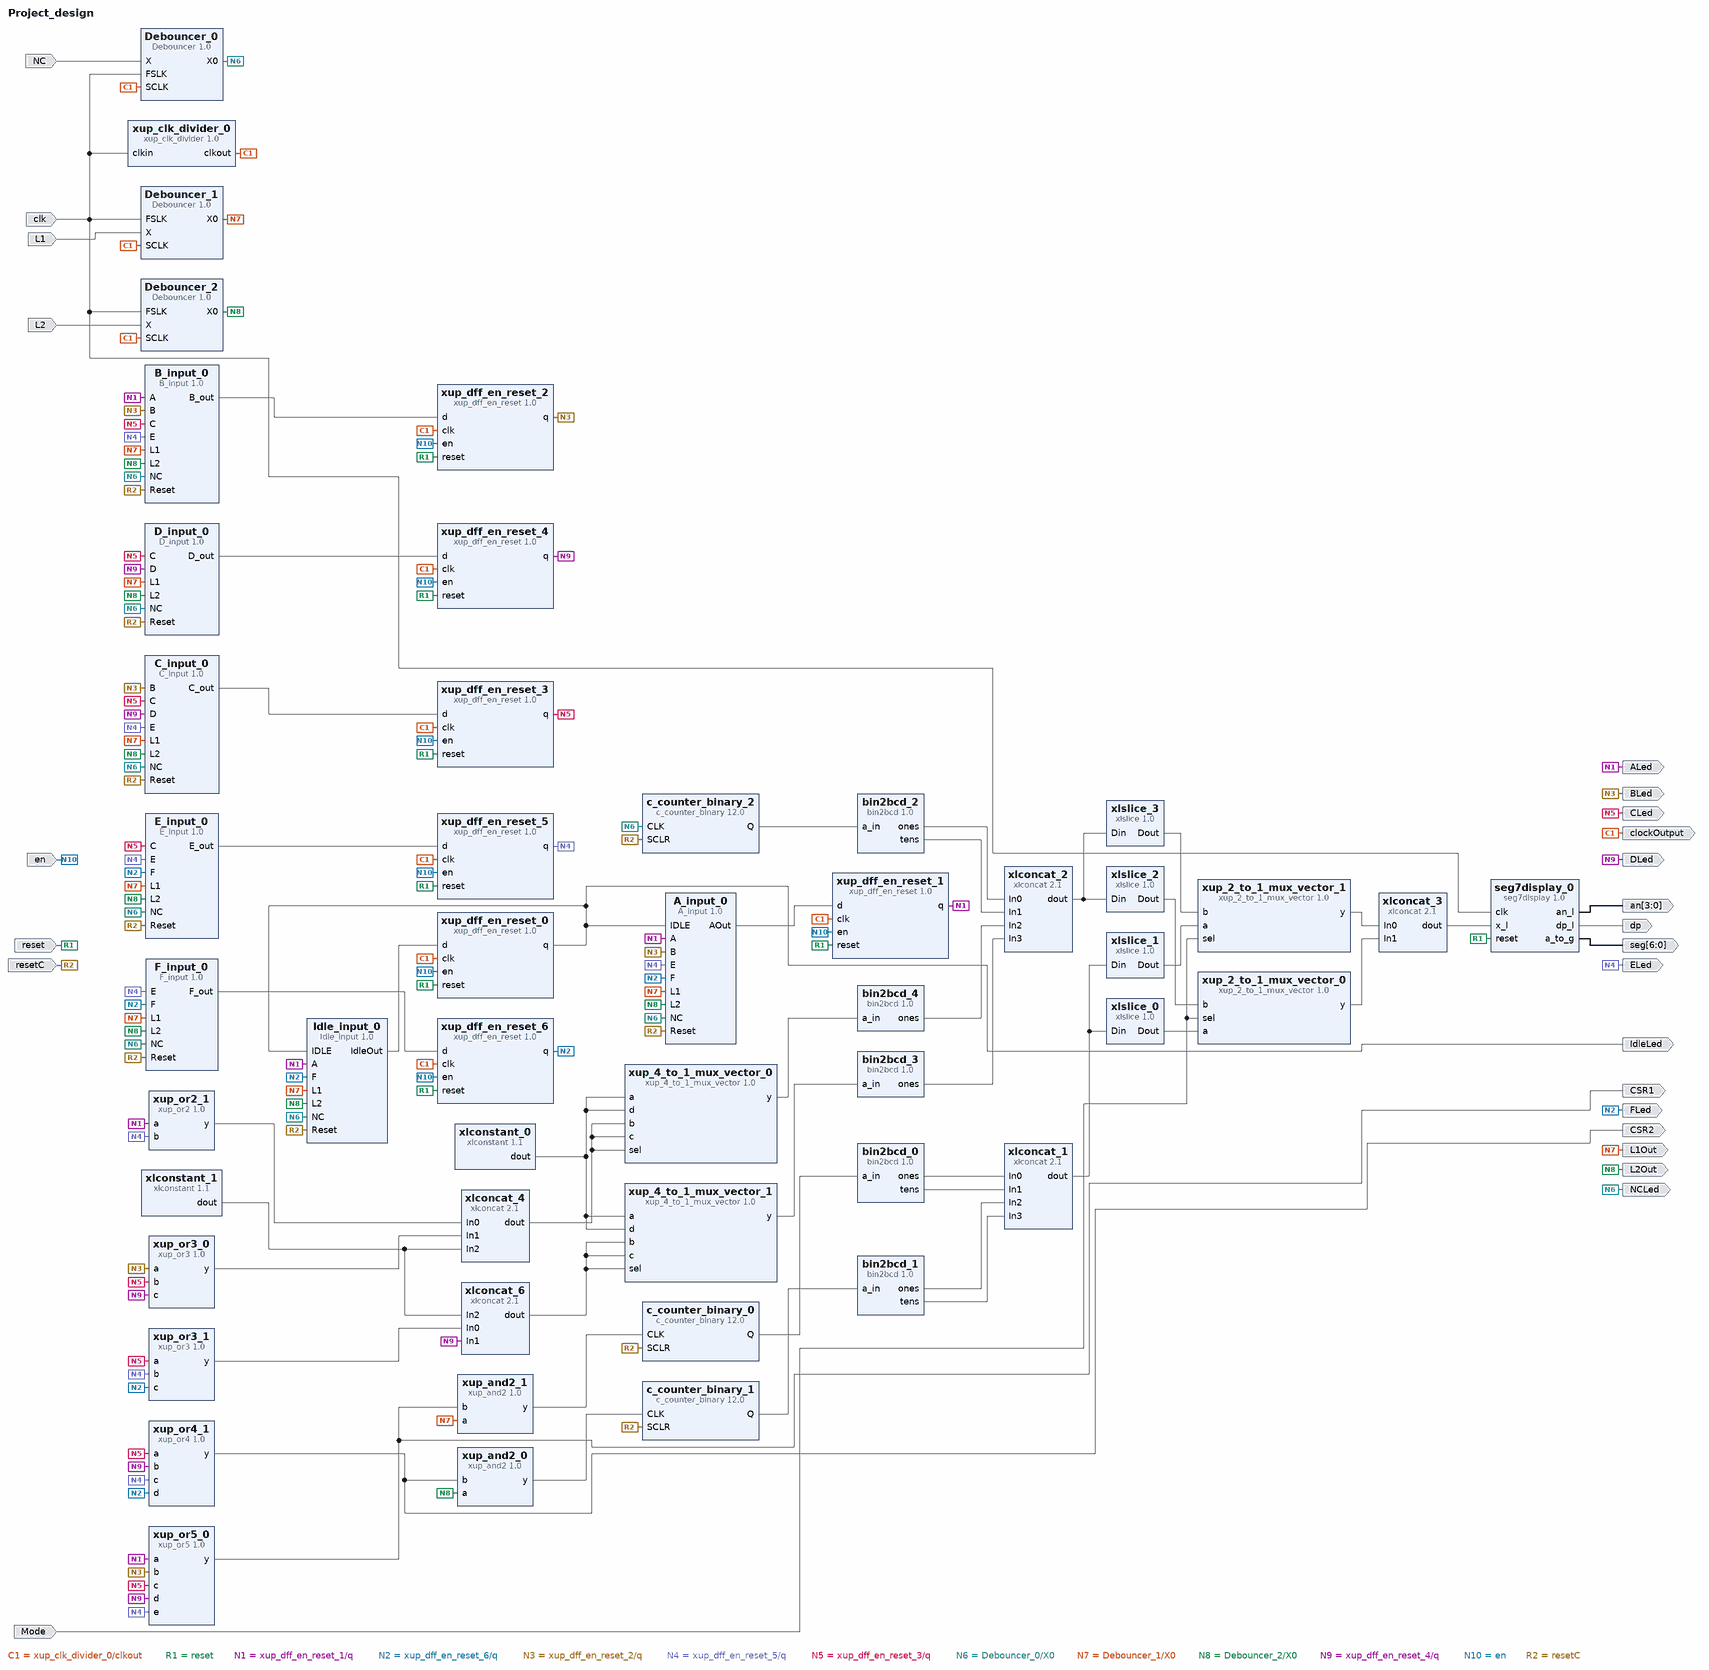
[diagram p0: block diagram of the top level]
# Vivado block design Project_design, xc7a35tcpg236-1, Vivado 2017.4
create_bd_design Project_design

create_bd_port -dir I -type clk clk
set_property -dict {CONFIG.FREQ_HZ 100000000} [get_bd_ports clk]
create_bd_port -dir O clockOutput
create_bd_port -dir I NC
create_bd_port -dir I L1
create_bd_port -dir I -type rst reset
set_property -dict {CONFIG.POLARITY ACTIVE_LOW} [get_bd_ports reset]
create_bd_port -dir O ALed
create_bd_port -dir O FLed
create_bd_port -dir O BLed
create_bd_port -dir O ELed
create_bd_port -dir O CLed
create_bd_port -dir O NCLed
create_bd_port -dir O L1Out
create_bd_port -dir O L2Out
create_bd_port -dir O DLed
create_bd_port -dir O CSR1
create_bd_port -dir O CSR2
create_bd_port -dir I L2
create_bd_port -dir O -from 6 -to 0 seg
create_bd_port -dir O IdleLed
create_bd_port -dir I en
create_bd_port -dir O dp
create_bd_port -dir O -from 3 -to 0 an
create_bd_port -dir I -type rst resetC
set_property -dict {CONFIG.POLARITY ACTIVE_HIGH} [get_bd_ports resetC]
create_bd_port -dir I Mode

create_bd_cell -type ip -vlnv xilinx.com:XUP:xup_dff_en_reset:1.0 xup_dff_en_reset_0
create_bd_cell -type ip -vlnv xilinx.com:XUP:xup_dff_en_reset:1.0 xup_dff_en_reset_1
create_bd_cell -type ip -vlnv xilinx.com:XUP:xup_dff_en_reset:1.0 xup_dff_en_reset_2
create_bd_cell -type ip -vlnv xilinx.com:XUP:xup_dff_en_reset:1.0 xup_dff_en_reset_3
create_bd_cell -type ip -vlnv xilinx.com:XUP:xup_dff_en_reset:1.0 xup_dff_en_reset_4
create_bd_cell -type ip -vlnv xilinx.com:XUP:xup_dff_en_reset:1.0 xup_dff_en_reset_5
create_bd_cell -type ip -vlnv xilinx.com:XUP:xup_dff_en_reset:1.0 xup_dff_en_reset_6
create_bd_cell -type ip -vlnv xilinx.com:XUP:xup_clk_divider:1.0 xup_clk_divider_0
set_property -dict {CONFIG.SIZE 200000000} [get_bd_cells xup_clk_divider_0]
create_bd_cell -type ip -vlnv xilinx.com:XUP:seg7display:1.0 seg7display_0
create_bd_cell -type ip -vlnv xilinx.com:XUP:xup_or5:1.0 xup_or5_0
create_bd_cell -type ip -vlnv xilinx.com:XUP:xup_or4:1.0 xup_or4_1
create_bd_cell -type ip -vlnv xilinx.com:ip:c_counter_binary:12.0 c_counter_binary_0
set_property -dict [list \
  CONFIG.Implementation Fabric \
  CONFIG.Output_Width 7 \
  CONFIG.Restrict_Count true \
  CONFIG.Final_Count_Value 63 \
  CONFIG.CE false \
  CONFIG.SCLR true \
] [get_bd_cells c_counter_binary_0]
create_bd_cell -type ip -vlnv xilinx.com:ip:c_counter_binary:12.0 c_counter_binary_1
set_property -dict [list \
  CONFIG.Output_Width 7 \
  CONFIG.Restrict_Count true \
  CONFIG.Final_Count_Value 63 \
  CONFIG.CE false \
  CONFIG.SCLR true \
] [get_bd_cells c_counter_binary_1]
create_bd_cell -type ip -vlnv xilinx.com:ip:xlconcat:2.1 xlconcat_1
set_property -dict [list \
  CONFIG.NUM_PORTS 4 \
  CONFIG.IN0_WIDTH 4 \
  CONFIG.IN1_WIDTH 4 \
  CONFIG.IN2_WIDTH 4 \
  CONFIG.IN3_WIDTH 4 \
  CONFIG.IN4_WIDTH 1 \
  CONFIG.IN5_WIDTH 1 \
] [get_bd_cells xlconcat_1]
create_bd_cell -type ip -vlnv xilinx.com:user:Debouncer:1.0 Debouncer_0
create_bd_cell -type ip -vlnv xilinx.com:user:Debouncer:1.0 Debouncer_1
create_bd_cell -type ip -vlnv xilinx.com:user:Debouncer:1.0 Debouncer_2
create_bd_cell -type ip -vlnv xilinx.com:XUP:bin2bcd:1.0 bin2bcd_0
set_property -dict {CONFIG.SIZE 7} [get_bd_cells bin2bcd_0]
create_bd_cell -type ip -vlnv xilinx.com:XUP:bin2bcd:1.0 bin2bcd_1
set_property -dict {CONFIG.SIZE 7} [get_bd_cells bin2bcd_1]
create_bd_cell -type ip -vlnv xilinx.com:user:Idle_input:1.0 Idle_input_0
create_bd_cell -type ip -vlnv xilinx.com:user:B_input:1.0 B_input_0
create_bd_cell -type ip -vlnv xilinx.com:user:C_input:1.0 C_input_0
create_bd_cell -type ip -vlnv xilinx.com:user:E_input:1.0 E_input_0
create_bd_cell -type ip -vlnv xilinx.com:user:F_input:1.0 F_input_0
create_bd_cell -type ip -vlnv xilinx.com:user:D_input:1.0 D_input_0
create_bd_cell -type ip -vlnv xilinx.com:ip:c_counter_binary:12.0 c_counter_binary_2
set_property -dict [list \
  CONFIG.Output_Width 7 \
  CONFIG.Restrict_Count true \
  CONFIG.Final_Count_Value 63 \
  CONFIG.CE false \
  CONFIG.SCLR true \
] [get_bd_cells c_counter_binary_2]
create_bd_cell -type ip -vlnv xilinx.com:ip:xlconcat:2.1 xlconcat_2
set_property -dict [list \
  CONFIG.NUM_PORTS 4 \
  CONFIG.IN0_WIDTH 4 \
  CONFIG.IN1_WIDTH 4 \
  CONFIG.IN2_WIDTH 4 \
  CONFIG.IN3_WIDTH 4 \
  CONFIG.IN4_WIDTH 1 \
  CONFIG.IN5_WIDTH 1 \
] [get_bd_cells xlconcat_2]
create_bd_cell -type ip -vlnv xilinx.com:XUP:bin2bcd:1.0 bin2bcd_2
set_property -dict {CONFIG.SIZE 7} [get_bd_cells bin2bcd_2]
create_bd_cell -type ip -vlnv xilinx.com:XUP:xup_2_to_1_mux_vector:1.0 xup_2_to_1_mux_vector_0
set_property -dict {CONFIG.SIZE 8} [get_bd_cells xup_2_to_1_mux_vector_0]
create_bd_cell -type ip -vlnv xilinx.com:XUP:xup_2_to_1_mux_vector:1.0 xup_2_to_1_mux_vector_1
set_property -dict {CONFIG.SIZE 8} [get_bd_cells xup_2_to_1_mux_vector_1]
create_bd_cell -type ip -vlnv xilinx.com:ip:xlconcat:2.1 xlconcat_3
set_property -dict [list \
  CONFIG.NUM_PORTS 2 \
  CONFIG.IN0_WIDTH 8 \
  CONFIG.IN1_WIDTH 8 \
  CONFIG.IN2_WIDTH 4 \
  CONFIG.IN3_WIDTH 4 \
  CONFIG.IN4_WIDTH 1 \
  CONFIG.IN5_WIDTH 1 \
] [get_bd_cells xlconcat_3]
create_bd_cell -type ip -vlnv xilinx.com:ip:xlslice:1.0 xlslice_0
set_property -dict {CONFIG.DIN_TO 8 CONFIG.DIN_FROM 15 CONFIG.DIN_WIDTH 16 CONFIG.DOUT_WIDTH 8} [get_bd_cells xlslice_0]
create_bd_cell -type ip -vlnv xilinx.com:ip:xlslice:1.0 xlslice_1
set_property -dict {CONFIG.DIN_TO 0 CONFIG.DIN_FROM 7 CONFIG.DIN_WIDTH 16 CONFIG.DOUT_WIDTH 8} [get_bd_cells xlslice_1]
create_bd_cell -type ip -vlnv xilinx.com:ip:xlslice:1.0 xlslice_2
set_property -dict {CONFIG.DIN_TO 8 CONFIG.DIN_FROM 15 CONFIG.DIN_WIDTH 16 CONFIG.DOUT_WIDTH 8} [get_bd_cells xlslice_2]
create_bd_cell -type ip -vlnv xilinx.com:ip:xlslice:1.0 xlslice_3
set_property -dict {CONFIG.DIN_TO 0 CONFIG.DIN_FROM 7 CONFIG.DIN_WIDTH 16 CONFIG.DOUT_WIDTH 8} [get_bd_cells xlslice_3]
create_bd_cell -type ip -vlnv xilinx.com:XUP:xup_or3:1.0 xup_or3_0
create_bd_cell -type ip -vlnv xilinx.com:XUP:xup_or2:1.0 xup_or2_1
create_bd_cell -type ip -vlnv xilinx.com:XUP:xup_4_to_1_mux_vector:1.0 xup_4_to_1_mux_vector_0
set_property -dict {CONFIG.SIZE 3} [get_bd_cells xup_4_to_1_mux_vector_0]
create_bd_cell -type ip -vlnv xilinx.com:ip:xlconcat:2.1 xlconcat_4
set_property -dict [list \
  CONFIG.NUM_PORTS 3 \
  CONFIG.IN0_WIDTH 1 \
  CONFIG.IN1_WIDTH 1 \
  CONFIG.IN2_WIDTH 1 \
  CONFIG.IN3_WIDTH 4 \
  CONFIG.IN4_WIDTH 1 \
  CONFIG.IN5_WIDTH 1 \
] [get_bd_cells xlconcat_4]
create_bd_cell -type ip -vlnv xilinx.com:ip:xlconstant:1.1 xlconstant_0
set_property -dict {CONFIG.CONST_WIDTH 3 CONFIG.CONST_VAL 0} [get_bd_cells xlconstant_0]
create_bd_cell -type ip -vlnv xilinx.com:XUP:bin2bcd:1.0 bin2bcd_3
set_property -dict {CONFIG.SIZE 3} [get_bd_cells bin2bcd_3]
create_bd_cell -type ip -vlnv xilinx.com:XUP:bin2bcd:1.0 bin2bcd_4
set_property -dict {CONFIG.SIZE 3} [get_bd_cells bin2bcd_4]
create_bd_cell -type ip -vlnv xilinx.com:ip:xlconstant:1.1 xlconstant_1
set_property -dict {CONFIG.CONST_WIDTH 1 CONFIG.CONST_VAL 0} [get_bd_cells xlconstant_1]
create_bd_cell -type ip -vlnv xilinx.com:XUP:xup_or3:1.0 xup_or3_1
create_bd_cell -type ip -vlnv xilinx.com:XUP:xup_4_to_1_mux_vector:1.0 xup_4_to_1_mux_vector_1
set_property -dict {CONFIG.SIZE 3} [get_bd_cells xup_4_to_1_mux_vector_1]
create_bd_cell -type ip -vlnv xilinx.com:ip:xlconcat:2.1 xlconcat_6
set_property -dict [list \
  CONFIG.NUM_PORTS 3 \
  CONFIG.IN0_WIDTH 1 \
  CONFIG.IN1_WIDTH 1 \
  CONFIG.IN2_WIDTH 1 \
  CONFIG.IN3_WIDTH 4 \
  CONFIG.IN4_WIDTH 1 \
  CONFIG.IN5_WIDTH 1 \
] [get_bd_cells xlconcat_6]
create_bd_cell -type ip -vlnv xilinx.com:user:A_input:1.0 A_input_0
create_bd_cell -type ip -vlnv xilinx.com:XUP:xup_and2:1.0 xup_and2_0
create_bd_cell -type ip -vlnv xilinx.com:XUP:xup_and2:1.0 xup_and2_1

# ---- connections ----

connect_bd_net [get_bd_ports clk] \
  [get_bd_pins xup_clk_divider_0/clkin] [get_bd_pins seg7display_0/clk] [get_bd_pins Debouncer_0/FSLK] \
  [get_bd_pins Debouncer_1/FSLK] [get_bd_pins Debouncer_2/FSLK]
connect_bd_net [get_bd_pins xup_clk_divider_0/clkout] \
  [get_bd_ports clockOutput] [get_bd_pins xup_dff_en_reset_0/clk] [get_bd_pins xup_dff_en_reset_1/clk] \
  [get_bd_pins xup_dff_en_reset_2/clk] [get_bd_pins xup_dff_en_reset_3/clk] [get_bd_pins xup_dff_en_reset_4/clk] \
  [get_bd_pins xup_dff_en_reset_5/clk] [get_bd_pins xup_dff_en_reset_6/clk] [get_bd_pins Debouncer_0/SCLK] \
  [get_bd_pins Debouncer_1/SCLK] [get_bd_pins Debouncer_2/SCLK]
connect_bd_net [get_bd_ports NC] [get_bd_pins Debouncer_0/X]
connect_bd_net -net L1_1 [get_bd_ports L1] [get_bd_pins Debouncer_1/X]
connect_bd_net [get_bd_ports reset] \
  [get_bd_pins xup_dff_en_reset_0/reset] [get_bd_pins xup_dff_en_reset_1/reset] [get_bd_pins xup_dff_en_reset_2/reset] \
  [get_bd_pins xup_dff_en_reset_3/reset] [get_bd_pins xup_dff_en_reset_4/reset] [get_bd_pins xup_dff_en_reset_5/reset] \
  [get_bd_pins xup_dff_en_reset_6/reset] [get_bd_pins seg7display_0/reset]
connect_bd_net [get_bd_pins xup_dff_en_reset_1/q] \
  [get_bd_ports ALed] [get_bd_pins xup_or5_0/a] [get_bd_pins Idle_input_0/A] [get_bd_pins B_input_0/A] \
  [get_bd_pins xup_or2_1/a] [get_bd_pins A_input_0/A]
connect_bd_net [get_bd_pins xup_dff_en_reset_6/q] \
  [get_bd_ports FLed] [get_bd_pins xup_or4_1/d] [get_bd_pins Idle_input_0/F] [get_bd_pins E_input_0/F] \
  [get_bd_pins F_input_0/F] [get_bd_pins xup_or3_1/c] [get_bd_pins A_input_0/F]
connect_bd_net [get_bd_pins xup_dff_en_reset_2/q] \
  [get_bd_ports BLed] [get_bd_pins xup_or5_0/b] [get_bd_pins B_input_0/B] [get_bd_pins C_input_0/B] [get_bd_pins xup_or3_0/a] \
  [get_bd_pins A_input_0/B]
connect_bd_net [get_bd_pins xup_dff_en_reset_5/q] \
  [get_bd_ports ELed] [get_bd_pins xup_or5_0/e] [get_bd_pins xup_or4_1/c] [get_bd_pins B_input_0/E] [get_bd_pins C_input_0/E] \
  [get_bd_pins E_input_0/E] [get_bd_pins F_input_0/E] [get_bd_pins xup_or2_1/b] [get_bd_pins xup_or3_1/b] \
  [get_bd_pins A_input_0/E]
connect_bd_net [get_bd_pins xup_dff_en_reset_3/q] \
  [get_bd_ports CLed] [get_bd_pins xup_or5_0/c] [get_bd_pins xup_or4_1/a] [get_bd_pins B_input_0/C] [get_bd_pins C_input_0/C] \
  [get_bd_pins E_input_0/C] [get_bd_pins D_input_0/C] [get_bd_pins xup_or3_0/b] [get_bd_pins xup_or3_1/a]
connect_bd_net [get_bd_pins Debouncer_0/X0] \
  [get_bd_ports NCLed] [get_bd_pins Idle_input_0/NC] [get_bd_pins B_input_0/NC] [get_bd_pins C_input_0/NC] \
  [get_bd_pins E_input_0/NC] [get_bd_pins F_input_0/NC] [get_bd_pins D_input_0/NC] [get_bd_pins c_counter_binary_2/CLK] \
  [get_bd_pins A_input_0/NC]
connect_bd_net [get_bd_pins Debouncer_1/X0] \
  [get_bd_ports L1Out] [get_bd_pins Idle_input_0/L1] [get_bd_pins B_input_0/L1] [get_bd_pins C_input_0/L1] \
  [get_bd_pins E_input_0/L1] [get_bd_pins F_input_0/L1] [get_bd_pins D_input_0/L1] [get_bd_pins A_input_0/L1] \
  [get_bd_pins xup_and2_1/a]
connect_bd_net [get_bd_pins Debouncer_2/X0] \
  [get_bd_ports L2Out] [get_bd_pins Idle_input_0/L2] [get_bd_pins B_input_0/L2] [get_bd_pins C_input_0/L2] \
  [get_bd_pins E_input_0/L2] [get_bd_pins F_input_0/L2] [get_bd_pins D_input_0/L2] [get_bd_pins A_input_0/L2] \
  [get_bd_pins xup_and2_0/a]
connect_bd_net [get_bd_pins B_input_0/B_out] [get_bd_pins xup_dff_en_reset_2/d]
connect_bd_net [get_bd_pins xup_dff_en_reset_4/q] \
  [get_bd_ports DLed] [get_bd_pins xup_or5_0/d] [get_bd_pins xup_or4_1/b] [get_bd_pins C_input_0/D] [get_bd_pins D_input_0/D] \
  [get_bd_pins xup_or3_0/c] [get_bd_pins xlconcat_6/In1]
connect_bd_net [get_bd_pins C_input_0/C_out] [get_bd_pins xup_dff_en_reset_3/d]
connect_bd_net [get_bd_pins D_input_0/D_out] [get_bd_pins xup_dff_en_reset_4/d]
connect_bd_net [get_bd_pins E_input_0/E_out] [get_bd_pins xup_dff_en_reset_5/d]
connect_bd_net [get_bd_pins F_input_0/F_out] [get_bd_pins xup_dff_en_reset_6/d]
connect_bd_net [get_bd_pins xup_or5_0/y] [get_bd_ports CSR1] [get_bd_pins xup_and2_1/b]
connect_bd_net [get_bd_pins xup_or4_1/y] [get_bd_ports CSR2] [get_bd_pins xup_and2_0/b]
connect_bd_net -net L2_1 [get_bd_ports L2] [get_bd_pins Debouncer_2/X]
connect_bd_net [get_bd_pins seg7display_0/a_to_g] [get_bd_ports seg]
connect_bd_net [get_bd_pins xup_dff_en_reset_0/q] [get_bd_ports IdleLed] [get_bd_pins Idle_input_0/IDLE] [get_bd_pins A_input_0/IDLE]
connect_bd_net [get_bd_pins A_input_0/AOut] [get_bd_pins xup_dff_en_reset_1/d]
connect_bd_net [get_bd_ports en] \
  [get_bd_pins xup_dff_en_reset_0/en] [get_bd_pins xup_dff_en_reset_1/en] [get_bd_pins xup_dff_en_reset_2/en] \
  [get_bd_pins xup_dff_en_reset_3/en] [get_bd_pins xup_dff_en_reset_4/en] [get_bd_pins xup_dff_en_reset_5/en] \
  [get_bd_pins xup_dff_en_reset_6/en]
connect_bd_net [get_bd_pins c_counter_binary_0/Q] [get_bd_pins bin2bcd_0/a_in]
connect_bd_net [get_bd_pins c_counter_binary_1/Q] [get_bd_pins bin2bcd_1/a_in]
connect_bd_net [get_bd_pins bin2bcd_0/ones] [get_bd_pins xlconcat_1/In0]
connect_bd_net [get_bd_pins seg7display_0/dp_l] [get_bd_ports dp]
connect_bd_net [get_bd_pins seg7display_0/an_l] [get_bd_ports an]
connect_bd_net [get_bd_pins bin2bcd_0/tens] [get_bd_pins xlconcat_1/In1]
connect_bd_net [get_bd_pins bin2bcd_1/ones] [get_bd_pins xlconcat_1/In2]
connect_bd_net [get_bd_pins bin2bcd_1/tens] [get_bd_pins xlconcat_1/In3]
connect_bd_net [get_bd_ports resetC] \
  [get_bd_pins c_counter_binary_0/SCLR] [get_bd_pins c_counter_binary_1/SCLR] [get_bd_pins Idle_input_0/Reset] \
  [get_bd_pins B_input_0/Reset] [get_bd_pins C_input_0/Reset] [get_bd_pins E_input_0/Reset] [get_bd_pins F_input_0/Reset] \
  [get_bd_pins D_input_0/Reset] [get_bd_pins c_counter_binary_2/SCLR] [get_bd_pins A_input_0/Reset]
connect_bd_net [get_bd_pins Idle_input_0/IdleOut] [get_bd_pins xup_dff_en_reset_0/d]
connect_bd_net [get_bd_pins c_counter_binary_2/Q] [get_bd_pins bin2bcd_2/a_in]
connect_bd_net [get_bd_pins bin2bcd_2/ones] [get_bd_pins xlconcat_2/In0]
connect_bd_net [get_bd_pins bin2bcd_2/tens] [get_bd_pins xlconcat_2/In1]
connect_bd_net [get_bd_ports Mode] [get_bd_pins xup_2_to_1_mux_vector_0/sel] [get_bd_pins xup_2_to_1_mux_vector_1/sel]
connect_bd_net [get_bd_pins xlconcat_1/dout] [get_bd_pins xlslice_0/Din] [get_bd_pins xlslice_1/Din]
connect_bd_net [get_bd_pins xlconcat_2/dout] [get_bd_pins xlslice_2/Din] [get_bd_pins xlslice_3/Din]
connect_bd_net [get_bd_pins xlslice_0/Dout] [get_bd_pins xup_2_to_1_mux_vector_0/a]
connect_bd_net [get_bd_pins xlslice_2/Dout] [get_bd_pins xup_2_to_1_mux_vector_0/b]
connect_bd_net [get_bd_pins xlslice_1/Dout] [get_bd_pins xup_2_to_1_mux_vector_1/a]
connect_bd_net [get_bd_pins xlslice_3/Dout] [get_bd_pins xup_2_to_1_mux_vector_1/b]
connect_bd_net [get_bd_pins xlconcat_3/dout] [get_bd_pins seg7display_0/x_l]
connect_bd_net [get_bd_pins xup_2_to_1_mux_vector_1/y] [get_bd_pins xlconcat_3/In0]
connect_bd_net [get_bd_pins xup_2_to_1_mux_vector_0/y] [get_bd_pins xlconcat_3/In1]
connect_bd_net [get_bd_pins xlconcat_4/dout] \
  [get_bd_pins xup_4_to_1_mux_vector_0/sel] [get_bd_pins xup_4_to_1_mux_vector_0/b] [get_bd_pins xup_4_to_1_mux_vector_0/c]
connect_bd_net [get_bd_pins xup_or2_1/y] [get_bd_pins xlconcat_4/In0]
connect_bd_net [get_bd_pins xup_or3_0/y] [get_bd_pins xlconcat_4/In1]
connect_bd_net [get_bd_pins xlconstant_0/dout] \
  [get_bd_pins xup_4_to_1_mux_vector_0/a] [get_bd_pins xup_4_to_1_mux_vector_0/d] [get_bd_pins xup_4_to_1_mux_vector_1/a] \
  [get_bd_pins xup_4_to_1_mux_vector_1/d]
connect_bd_net [get_bd_pins xlconstant_1/dout] [get_bd_pins xlconcat_4/In2] [get_bd_pins xlconcat_6/In2]
connect_bd_net [get_bd_pins xup_4_to_1_mux_vector_0/y] [get_bd_pins bin2bcd_4/a_in]
connect_bd_net [get_bd_pins bin2bcd_4/ones] [get_bd_pins xlconcat_2/In2]
connect_bd_net [get_bd_pins bin2bcd_3/ones] [get_bd_pins xlconcat_2/In3]
connect_bd_net [get_bd_pins xup_4_to_1_mux_vector_1/y] [get_bd_pins bin2bcd_3/a_in]
connect_bd_net [get_bd_pins xup_or3_1/y] [get_bd_pins xlconcat_6/In0]
connect_bd_net [get_bd_pins xlconcat_6/dout] \
  [get_bd_pins xup_4_to_1_mux_vector_1/sel] [get_bd_pins xup_4_to_1_mux_vector_1/b] [get_bd_pins xup_4_to_1_mux_vector_1/c]
connect_bd_net [get_bd_pins xup_and2_1/y] [get_bd_pins c_counter_binary_0/CLK]
connect_bd_net [get_bd_pins xup_and2_0/y] [get_bd_pins c_counter_binary_1/CLK]

validate_bd_design
save_bd_design
